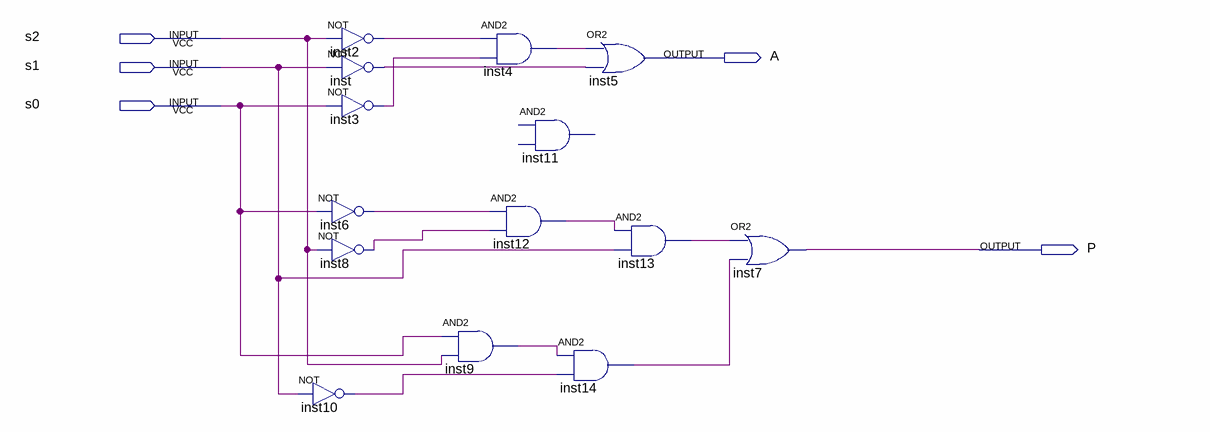
[diagram p0: schematic sheet]
// Quartus schematic Lab5.bdf as structural Verilog: 14 symbols, 5 pins
module Lab5 (
  input  s2,
  input  s1,
  input  s0,
  output A,
  output P
);

  wire inst2_out, inst3_out, inst4_out, inst6_out, inst8_out, inst9_out, inst10_out, inst12_out, inst13_out,
       inst14_out, inst_out;

  not inst2 (inst2_out, s2);
  not inst (inst_out, s1);
  not inst3 (inst3_out, s0);
  not inst6 (inst6_out, s0);
  not inst8 (inst8_out, s2);
  not inst10 (inst10_out, s1);
  and inst4 (inst4_out, inst2_out, inst3_out);
  and inst12 (inst12_out, inst6_out, inst8_out);
  and inst9 (inst9_out, s0, s2);
  // AND2 inst11 is placed but not wired
  and inst14 (inst14_out, inst9_out, inst10_out);
  or inst5 (A, inst4_out, inst_out);
  and inst13 (inst13_out, inst12_out, s1);
  or inst7 (P, inst13_out, inst14_out);
endmodule
